# EAGLE design Draft 2 (EAGLE 9.6.2)
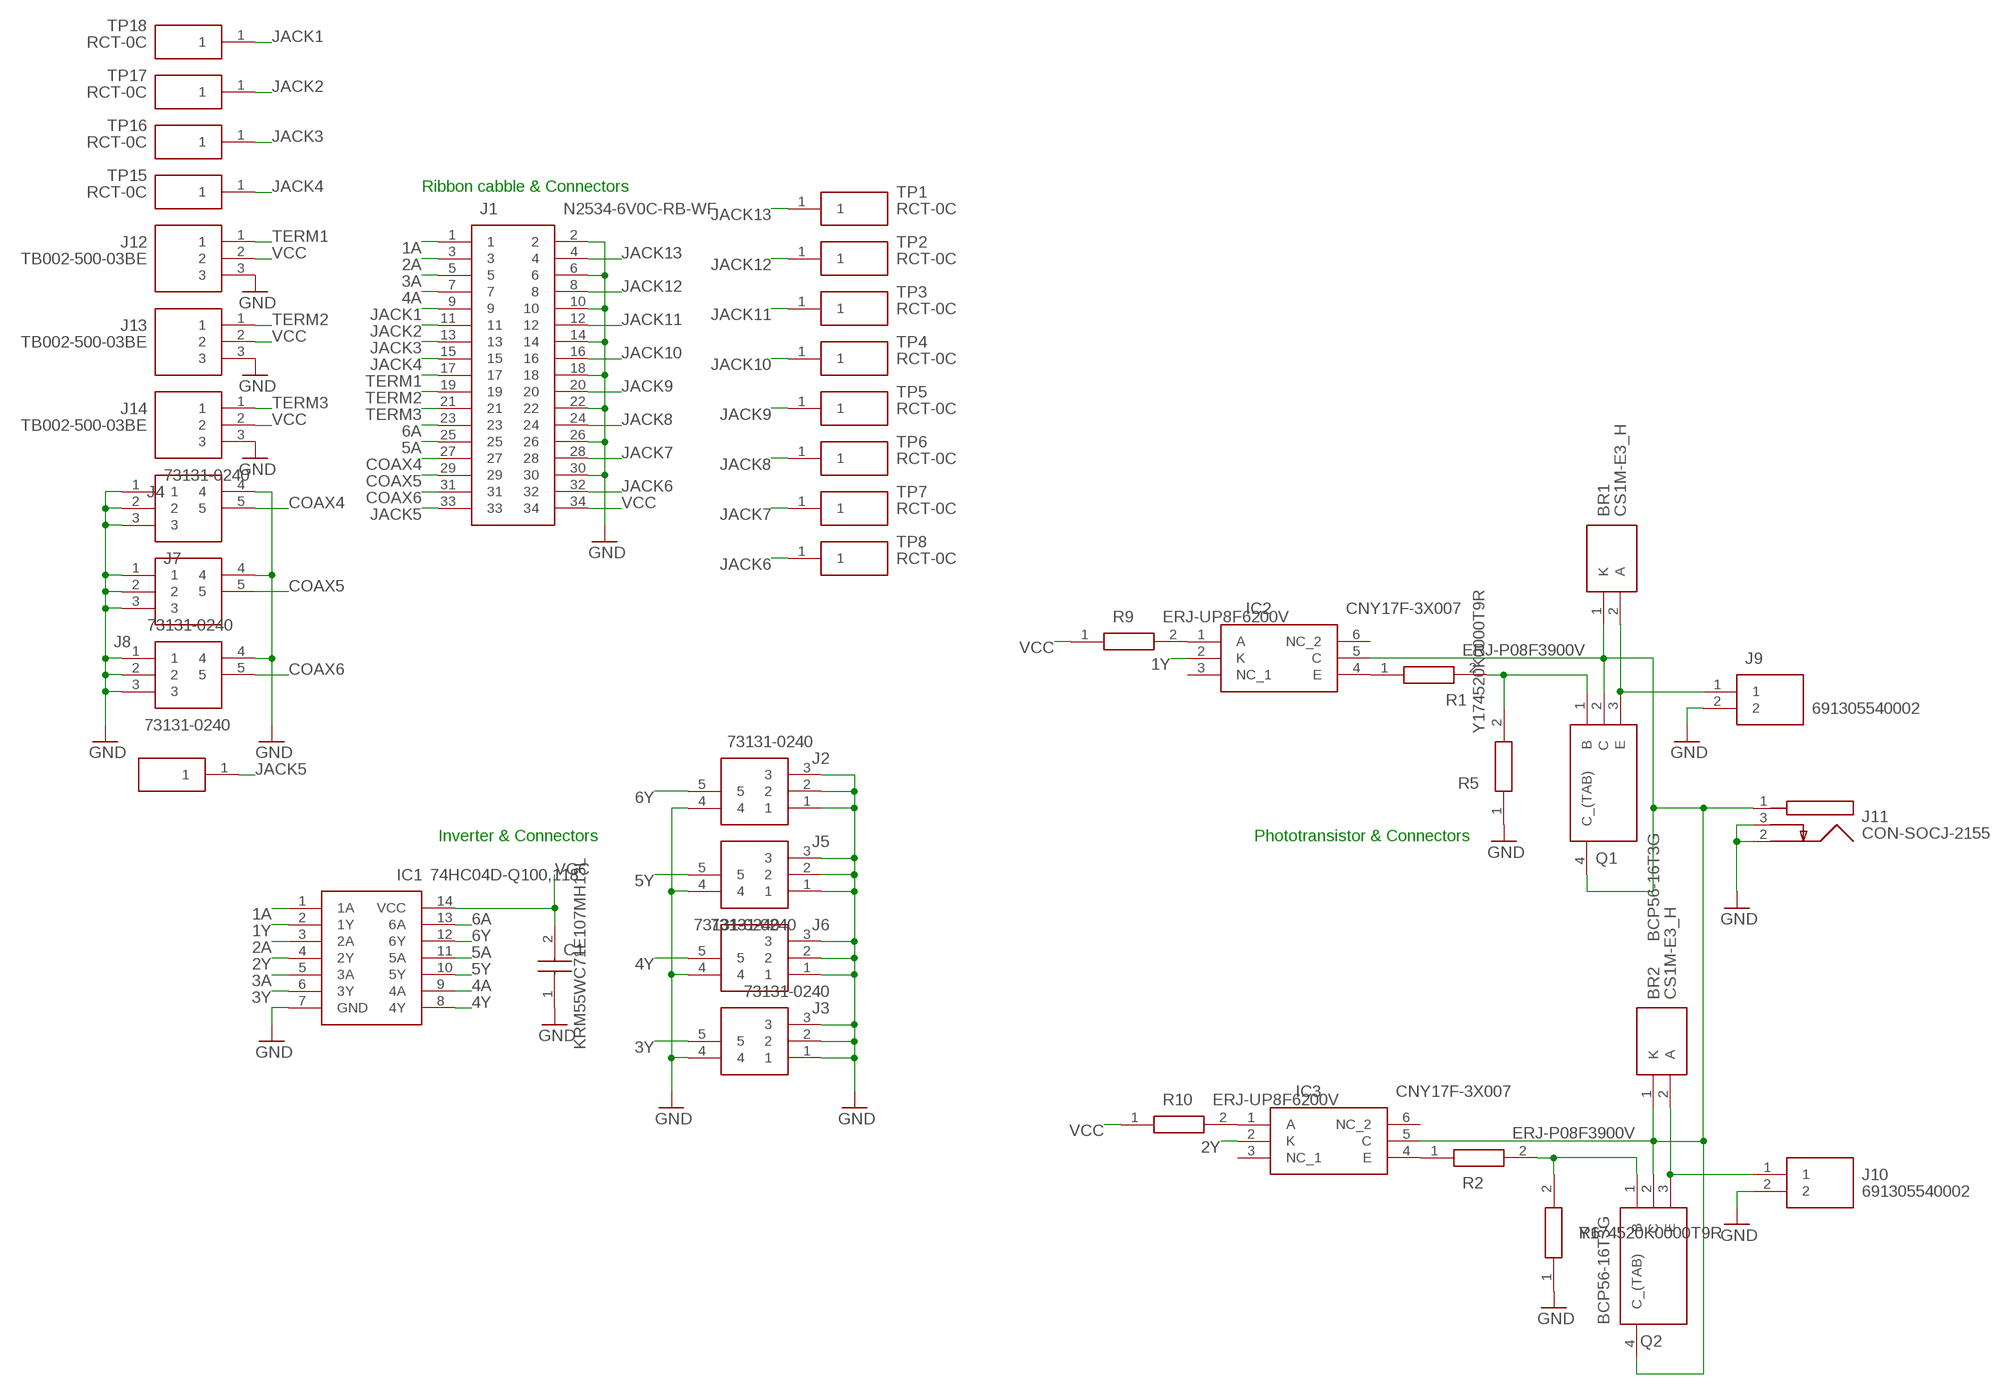
[diagram p0: schematic, sheet 1]

## Parts
BR1  CS1M-E3_H  [DIOM5127X229N]
BR2  CS1M-E3_H  [DIOM5127X229N]
C1  KRM55WC71E107MH13L  [CAPC6153X670N]
IC1  74HC04D-Q100,118  [SOIC127P600X175-14N]
IC2  CNY17F-3X007  [SOP254P1030X440-6N]
IC3  CNY17F-3X007  [SOP254P1030X440-6N]
J1  N2534-6V0C-RB-WF  [3M_N2534-6V0C-RB-WF]
J2  73131-0240  [731310240]
J3  73131-0240  [731310240]
J4  73131-0240  [731310240]
J5  73131-0240  [731310240]
J6  73131-0240  [731310240]
J7  73131-0240  [731310240]
J8  73131-0240  [731310240]
J9  691305540002  [SHDRRA2W100P0X508_1X2_1216X120]
J10  691305540002  [SHDRRA2W100P0X508_1X2_1216X120]
J11  CON-SOCJ-2155  [CONSOCJ2155]
J12  TB002-500-03BE  [SHDR3W100P0X500_1X3_1500X760X1]
J13  TB002-500-03BE  [SHDR3W100P0X500_1X3_1500X760X1]
J14  TB002-500-03BE  [SHDR3W100P0X500_1X3_1500X760X1]
Q1  BCP56-16T3G  [SOT230P700X175-4N]
Q2  BCP56-16T3G  [SOT230P700X175-4N]
R1  ERJ-P08F3900V  [RESC3116X70N]
R2  ERJ-P08F3900V  [RESC3116X70N]
R5  Y174520K0000T9R  [RESM6032X279N]
R6  Y174520K0000T9R  [RESM6032X279N]
R9  ERJ-UP8F6200V  [RESC3116X70N]
R10  ERJ-UP8F6200V  [RESC3116X70N]
TP1  RCT-0C  [RCT-0C]
TP2  RCT-0C  [RCT-0C]
TP3  RCT-0C  [RCT-0C]
TP4  RCT-0C  [RCT-0C]
TP5  RCT-0C  [RCT-0C]
TP6  RCT-0C  [RCT-0C]
TP7  RCT-0C  [RCT-0C]
TP8  RCT-0C  [RCT-0C]
TP9  RCT-0C  [RCT-0C]
TP15  RCT-0C  [RCT-0C]
TP16  RCT-0C  [RCT-0C]
TP17  RCT-0C  [RCT-0C]
TP18  RCT-0C  [RCT-0C]

## Nets
1A: IC1.1(1A) J1.1
1Y: IC1.2(1Y) IC2.2(K)
2A: IC1.3(2A) J1.3
2Y: IC1.4(2Y) IC3.2(K)
3A: IC1.5(3A) J1.5
3Y: IC1.6(3Y) J3.5
4A: IC1.9(4A) J1.7
4Y: IC1.8(4Y) J6.5
5A: IC1.11(5A) J1.25
5Y: IC1.10(5Y) J5.5
6A: IC1.13(6A) J1.23
6Y: IC1.12(6Y) J2.5
COAX4: J1.27 J4.5
COAX5: J1.29 J7.5
COAX6: J1.31 J8.5
GND: C1.1 IC1.7(GND) J1.2 J1.6 J1.10 J1.14 J1.18 J1.22 J1.26 J1.30 J2.1 J2.2 J2.3 J2.4 J3.1 J3.2 J3.3 J3.4 J4.1 J4.2 J4.3 J4.4 J5.1 J5.2 J5.3 J5.4 J6.1 J6.2 J6.3 J6.4 J7.1 J7.2 J7.3 J7.4 J8.1 J8.2 J8.3 J8.4 J9.2 J10.2 J11.2 J11.3 J12.3 J13.3 J14.3 R5.1 R6.1
JACK1: J1.9 TP18.1
JACK2: J1.11 TP17.1
JACK3: J1.13 TP16.1
JACK4: J1.15 TP15.1
JACK5: J1.33 TP9.1
JACK6: J1.32 TP8.1
JACK7: J1.28 TP7.1
JACK8: J1.24 TP6.1
JACK9: J1.20 TP5.1
JACK10: J1.16 TP4.1
JACK11: J1.12 TP3.1
JACK12: J1.8 TP2.1
JACK13: J1.4 TP1.1
N$1: IC2.1(A) R9.2
N$2: BR2.2(A) J10.1 Q2.3(E)
N$3: Q1.1(B) R1.2 R5.2
N$4: IC3.1(A) R10.2
N$5: IC3.4(E) R2.1
N$6: IC2.4(E) R1.1
N$7: BR1.2(A) J9.1 Q1.3(E)
N$8: BR1.1(K) BR2.1(K) IC2.5(C) IC3.5(C) J11.1 Q1.2(C) Q1.4(C_(TAB)) Q2.2(C) Q2.4(C_(TAB))
N$11: Q2.1(B) R2.2 R6.2
TERM1: J1.17 J12.1
TERM2: J1.19 J13.1
TERM3: J1.21 J14.1
VCC: C1.2 IC1.14(VCC) J1.34 J12.2 J13.2 J14.2 R9.1 R10.1
Unconnected: IC2.3(NC_1) IC2.6(NC_2) IC3.3(NC_1) IC3.6(NC_2)

## Notes on the sheet
- Ribbon cabble & Connectors
- Inverter & Connectors | Phototransistor & Connectors

## Library data of the parts
BR1 BR2 = SamacSys_Parts:CS1M-E3_H: 1A, 1000V, SMA, STD GPP SM REC Source: Datasheet <https://www.arrow.com/en/products/cs1m-e3h/vishay>; DESCRIPTION: 1A, 1000V, SMA, STD GPP SM REC; HEIGHT: 2.29mm; MANUFACTURER_NAME: Vishay; MANUFACTURER_PART_NUMBER: CS1M-E3/H; MOUSER_PART_NUMBER: 78-CS1M-E3/H; MOUSER_PRICE-STOCK: https://www.mouser.co.uk/ProductDetail/Vishay-Semiconductors/CS1M-E3-H?qs=rKqJIm0tnYHmxMgyZiw7hg%3D%3D
C1 = SamacSys_Parts:KRM55WC71E107MH13L: Capacitor KRM55 L=6.1mm W=5.3mm T=6.4mm Source: Datasheet <https://psearch.en.murata.com/capacitor/product/KRM55WC71E107MH13#.html>; DESCRIPTION: Capacitor KRM55 L=6.1mm W=5.3mm T=6.4mm; HEIGHT: 6.7mm; MANUFACTURER_NAME: Murata Electronics; MANUFACTURER_PART_NUMBER: KRM55WC71E107MH13L; MOUSER_PART_NUMBER: 81-KRM55WC71E107MH3L; MOUSER_PRICE-STOCK: https://www.mouser.co.uk/ProductDetail/Murata-Electronics/KRM55WC71E107MH13L?qs=rrS6PyfT74e7c6qJ%252BBHpFw%3D%3D
IC1 = SamacSys_Parts:74HC04D-Q100,118: 74HC(T)04-Q100 - Hex inverter@en-us Source: Datasheet <https://assets.nexperia.com/documents/data-sheet/74HC_HCT04_Q100.pdf>; DESCRIPTION: 74HC(T)04-Q100 - Hex inverter@en-us; HEIGHT: 1.75mm; MANUFACTURER_NAME: Nexperia; MANUFACTURER_PART_NUMBER: 74HC04D-Q100,118; MOUSER_PART_NUMBER: 771-74HC04D-Q100; MOUSER_PRICE-STOCK: https://www.mouser.co.uk/ProductDetail/Nexperia/74HC04D-Q100118?qs=1sbE9T7hb3aCZG2r%2FgRdOw%3D%3D
IC2 IC3 = SamacSys_Parts:CNY17F-3X007: Transistor Output Optocouplers Phototransistor Out Single CTR 100-200% Source: Datasheet <http://www.vishay.com/docs/83607/cny17f.pdf>; DESCRIPTION: Transistor Output Optocouplers Phototransistor Out Single CTR 100-200%; HEIGHT: 4.4mm; MANUFACTURER_NAME: Vishay; MANUFACTURER_PART_NUMBER: CNY17F-3X007; MOUSER_PART_NUMBER: 782-CNY17F-3X007; MOUSER_PRICE-STOCK: https://www.mouser.com/Search/Refine.aspx?Keyword=782-CNY17F-3X007
J1 = SamacSys_Parts:N2534-6V0C-RB-WF: Header Source: Datasheet; DESCRIPTION: Header; HEIGHT: mm; MANUFACTURER_NAME: 3M; MANUFACTURER_PART_NUMBER: N2534-6V0C-RB-WF; MOUSER_PART_NUMBER: 517-N2534-6V0C-RB-WF; MOUSER_PRICE-STOCK: https://www.mouser.co.uk/ProductDetail/3M-Electronic-Solutions-Division/N2534-6V0C-RB-WF?qs=Lbk6Md3wKLv0ax0Gs1M41Q%3D%3D; RS_PART_NUMBER: 0212650; RS_PRICE-STOCK: http://uk.rs-online.com/web/p/products/0212650
J2-J8 = SamacSys_Parts:73131-0240: RF Connectors / Coaxial Connectors 50 OHM BNC JACK R/A R/A PCB RECEPTACLE Source: Datasheet <https://www.mouser.com/datasheet/2/276/0731310240_RF_COAX_CONNECTORS-173081.pdf>; ARROW_PART_NUMBER: 73131-0240; DESCRIPTION: RF Connectors / Coaxial Connectors 50 OHM BNC JACK R/A R/A PCB RECEPTACLE; HEIGHT: 18.6mm; MANUFACTURER_NAME: Molex; MANUFACTURER_PART_NUMBER: 73131-0240; MOUSER_PART_NUMBER: 538-73131-0240; MOUSER_PRICE-STOCK: https://www.mouser.co.uk/ProductDetail/Molex/73131-0240?qs=zjYOnnZgb1sGqulDfbggfg%3D%3D
J9 J10 = SamacSys_Parts:691305540002: 5.08 mm Terminal Block PCB Header Horizo Source: Datasheet <https://www.we-online.com/catalog/datasheet/691305540002.pdf>; ARROW_PART_NUMBER: 691305540002; DESCRIPTION: 5.08 mm Terminal Block PCB Header Horizo; HEIGHT: 9.2mm; MANUFACTURER_NAME: Wurth Elektronik; MANUFACTURER_PART_NUMBER: 691305540002; MOUSER_PART_NUMBER: 710-691305540002; MOUSER_PRICE-STOCK: https://www.mouser.co.uk/ProductDetail/Wurth-Elektronik/691305540002?qs=2WXlatMagcE8Kf37bwMEoA%3D%3D
J11 = SamacSys_Parts:CON-SOCJ-2155: DC Power Connectors Power Jack/Connector 2.1mm x 5.5mm Source: Datasheet <http://www.produktinfo.conrad.com/datenblaetter/1500000-1599999/001582350-da-01-en-DC_EINBAUBUCHSE__SCHALTER_GESCHLOSSEN.pdf>; ARROW_PART_NUMBER: CON-SOCJ-2155; DESCRIPTION: DC Power Connectors Power Jack/Connector 2.1mm x 5.5mm; HEIGHT: 11mm; MANUFACTURER_NAME: Gravitech; MANUFACTURER_PART_NUMBER: CON-SOCJ-2155; MOUSER_PART_NUMBER: 992-CON-SOCJ-2155; MOUSER_PRICE-STOCK: https://www.mouser.co.uk/ProductDetail/Gravitech/CON-SOCJ-2155?qs=fkzBJ5HM%252BdCcpvFQyQZHtA%3D%3D
J12-J14 = SamacSys_Parts:TB002-500-03BE: Fixed Terminal Blocks screw type, 5.00 , horizontal, 3 poles, CUI Blue, slotted screw, PCB mount Source: Datasheet <https://www.cuidevices.com/product/resource/tb002-500.pdf>; ARROW_PART_NUMBER: TB002-500-03BE; ARROW_PRICE-STOCK: https://www.arrow.com/en/products/tb002-500-03be/cui-inc; DESCRIPTION: Fixed Terminal Blocks screw type, 5.00 , horizontal, 3 poles, CUI Blue, slotted screw, PCB mount; HEIGHT: 10mm; MANUFACTURER_NAME: CUI Devices; MANUFACTURER_PART_NUMBER: TB002-500-03BE; MOUSER_PART_NUMBER: 490-TB002-500-03BE; MOUSER_PRICE-STOCK: https://www.mouser.co.uk/ProductDetail/CUI-Devices/TB002-500-03BE?qs=vLWxofP3U2xKqUO2wcZ40g%3D%3D
Q1 Q2 = SamacSys_Parts:BCP56-16T3G: Source: Datasheet <http://www.onsemi.com/pub/Collateral/BCP56T1-D.PDF>; ALLIED_NUMBER: 70275391; ALLIED_PRICE-STOCK: http://www.alliedelec.com/on-semiconductor-bcp56-16t3g/70275391/; HEIGHT: 1.75mm; MANUFACTURER_NAME: ON Semiconductor; MANUFACTURER_PART_NUMBER: BCP56-16T3G; MOUSER_PART_NUMBER: 863-BCP56-16T3G; MOUSER_PRICE-STOCK: https://www.mouser.co.uk/ProductDetail/ON-Semiconductor/BCP56-16T3G?qs=vNc2DXHODiKP3hbUlJd5DQ%3D%3D; RS_PART_NUMBER: 7737633P; RS_PRICE-STOCK: http://uk.rs-online.com/web/p/products/7737633P
R1 R2 = SamacSys_Parts:ERJ-P08F3900V: Panasonic ERJP08 Series Thick Film Surface Mount Resistor 1206 Case 390 +/-1% 0.66W +/-100ppm/C Source: Datasheet <http://industrial.panasonic.com/cdbs/www-data/pdf/RDA0000/AOA0000C102.pdf>; DESCRIPTION: Panasonic ERJP08 Series Thick Film Surface Mount Resistor 1206 Case 390 +/-1% 0.66W +/-100ppm/C; HEIGHT: 0.7mm; MANUFACTURER_NAME: Panasonic; MANUFACTURER_PART_NUMBER: ERJ-P08F3900V; MOUSER_PART_NUMBER: 667-ERJ-P08F3900V; MOUSER_PRICE-STOCK: https://www.mouser.co.uk/ProductDetail/Panasonic/ERJ-P08F3900V?qs=iIVTEDlrHA34N3nekEJZFg%3D%3D
R5 R6 = SamacSys_Parts:Y174520K0000T9R: Vishay SMR1DZ Series Metal Foil Fixed Resistor 20k +/-0.01% 0.16W +/-0.2ppm/C Source: Datasheet <http://www.vishaypg.com/docs/63118/smrxdz.pdf>; ALLIED_NUMBER: 70067682; ALLIED_PRICE-STOCK: https://www.alliedelec.com/vishayprecisionfoilinc-y174520k0000t9r/70067682/; DESCRIPTION: Vishay SMR1DZ Series Metal Foil Fixed Resistor 20k +/-0.01% 0.16W +/-0.2ppm/C; HEIGHT: 2.79mm; MANUFACTURER_NAME: Vishay; MANUFACTURER_PART_NUMBER: Y174520K0000T9R; MOUSER_PART_NUMBER: 71-SMR1DZ20K000TST; MOUSER_PRICE-STOCK: https://www.mouser.co.uk/ProductDetail/Vishay-Precision-Group-Foil-Resistors/Y174520K0000T9R?qs=DTo5u7NUXXFYsAqpdaWYtQ%3D%3D; RS_PART_NUMBER: 7637249P; RS_PRICE-STOCK: http://uk.rs-online.com/web/p/products/7637249P
R9 R10 = SamacSys_Parts:ERJ-UP8F6200V: Thick Film Resistors - SMD 1206 0.66W 1% 620ohm Anti-Sulfur AEC-Q200 Source: Datasheet <https://www.mouser.com/datasheet/2/315/AOA0000C337-1276285.pdf>; DESCRIPTION: Thick Film Resistors - SMD 1206 0.66W 1% 620ohm Anti-Sulfur AEC-Q200; HEIGHT: 0.7mm; MANUFACTURER_NAME: Panasonic; MANUFACTURER_PART_NUMBER: ERJ-UP8F6200V; MOUSER_PART_NUMBER: 667-ERJ-UP8F6200V; MOUSER_PRICE-STOCK: https://www.mouser.co.uk/ProductDetail/Panasonic/ERJ-UP8F6200V?qs=gTYE2QTfZfQ%252BTsOVxw%252Bj1A%3D%3D
TP1-TP9 TP15-TP18 = SamacSys_Parts:RCT-0C: TE CONNECTIVITY / CGS - RCT-0C - TEST POINT, 0805 CASE SIZE Source: Datasheet <http://www.farnell.com/datasheets/80691.pdf>; ARROW_PART_NUMBER: RCT-0C; ARROW_PRICE-STOCK: https://www.arrow.com/en/products/rct-0c/te-connectivity; DESCRIPTION: TE CONNECTIVITY / CGS - RCT-0C - TEST POINT, 0805 CASE SIZE; HEIGHT: mm; MANUFACTURER_NAME: TE Connectivity; MANUFACTURER_PART_NUMBER: RCT-0C; MOUSER_PART_NUMBER: 279-RCT-0C; MOUSER_PRICE-STOCK: https://www.mouser.co.uk/ProductDetail/TE-Connectivity-Holsworthy/RCT-0C?qs=ip69W3eHERWzZOsRKmFYAw%3D%3D

## Net classes
0 default: width 0.508 mm

## Board
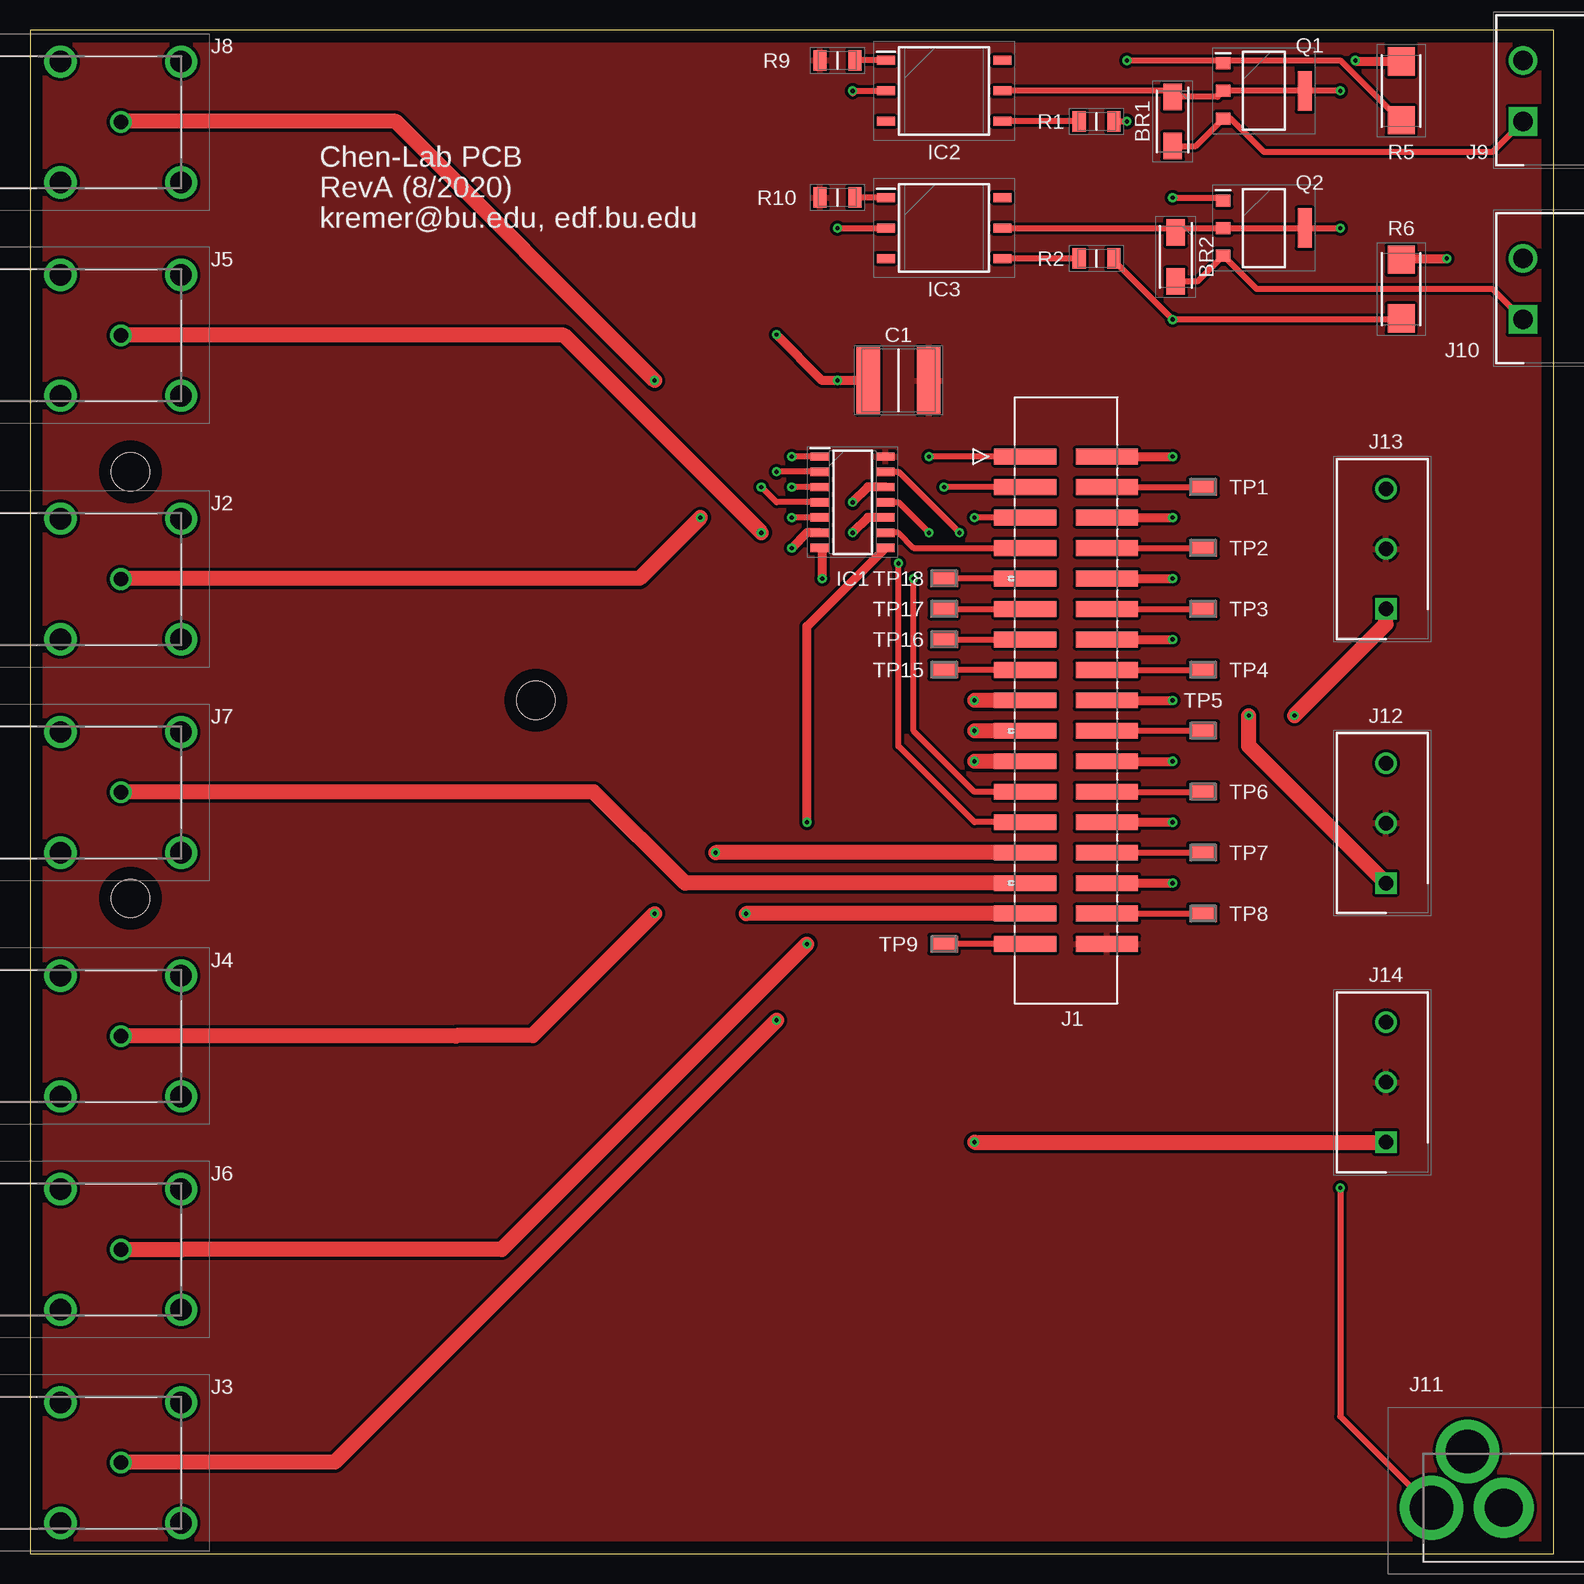
[diagram p1: board, top side]
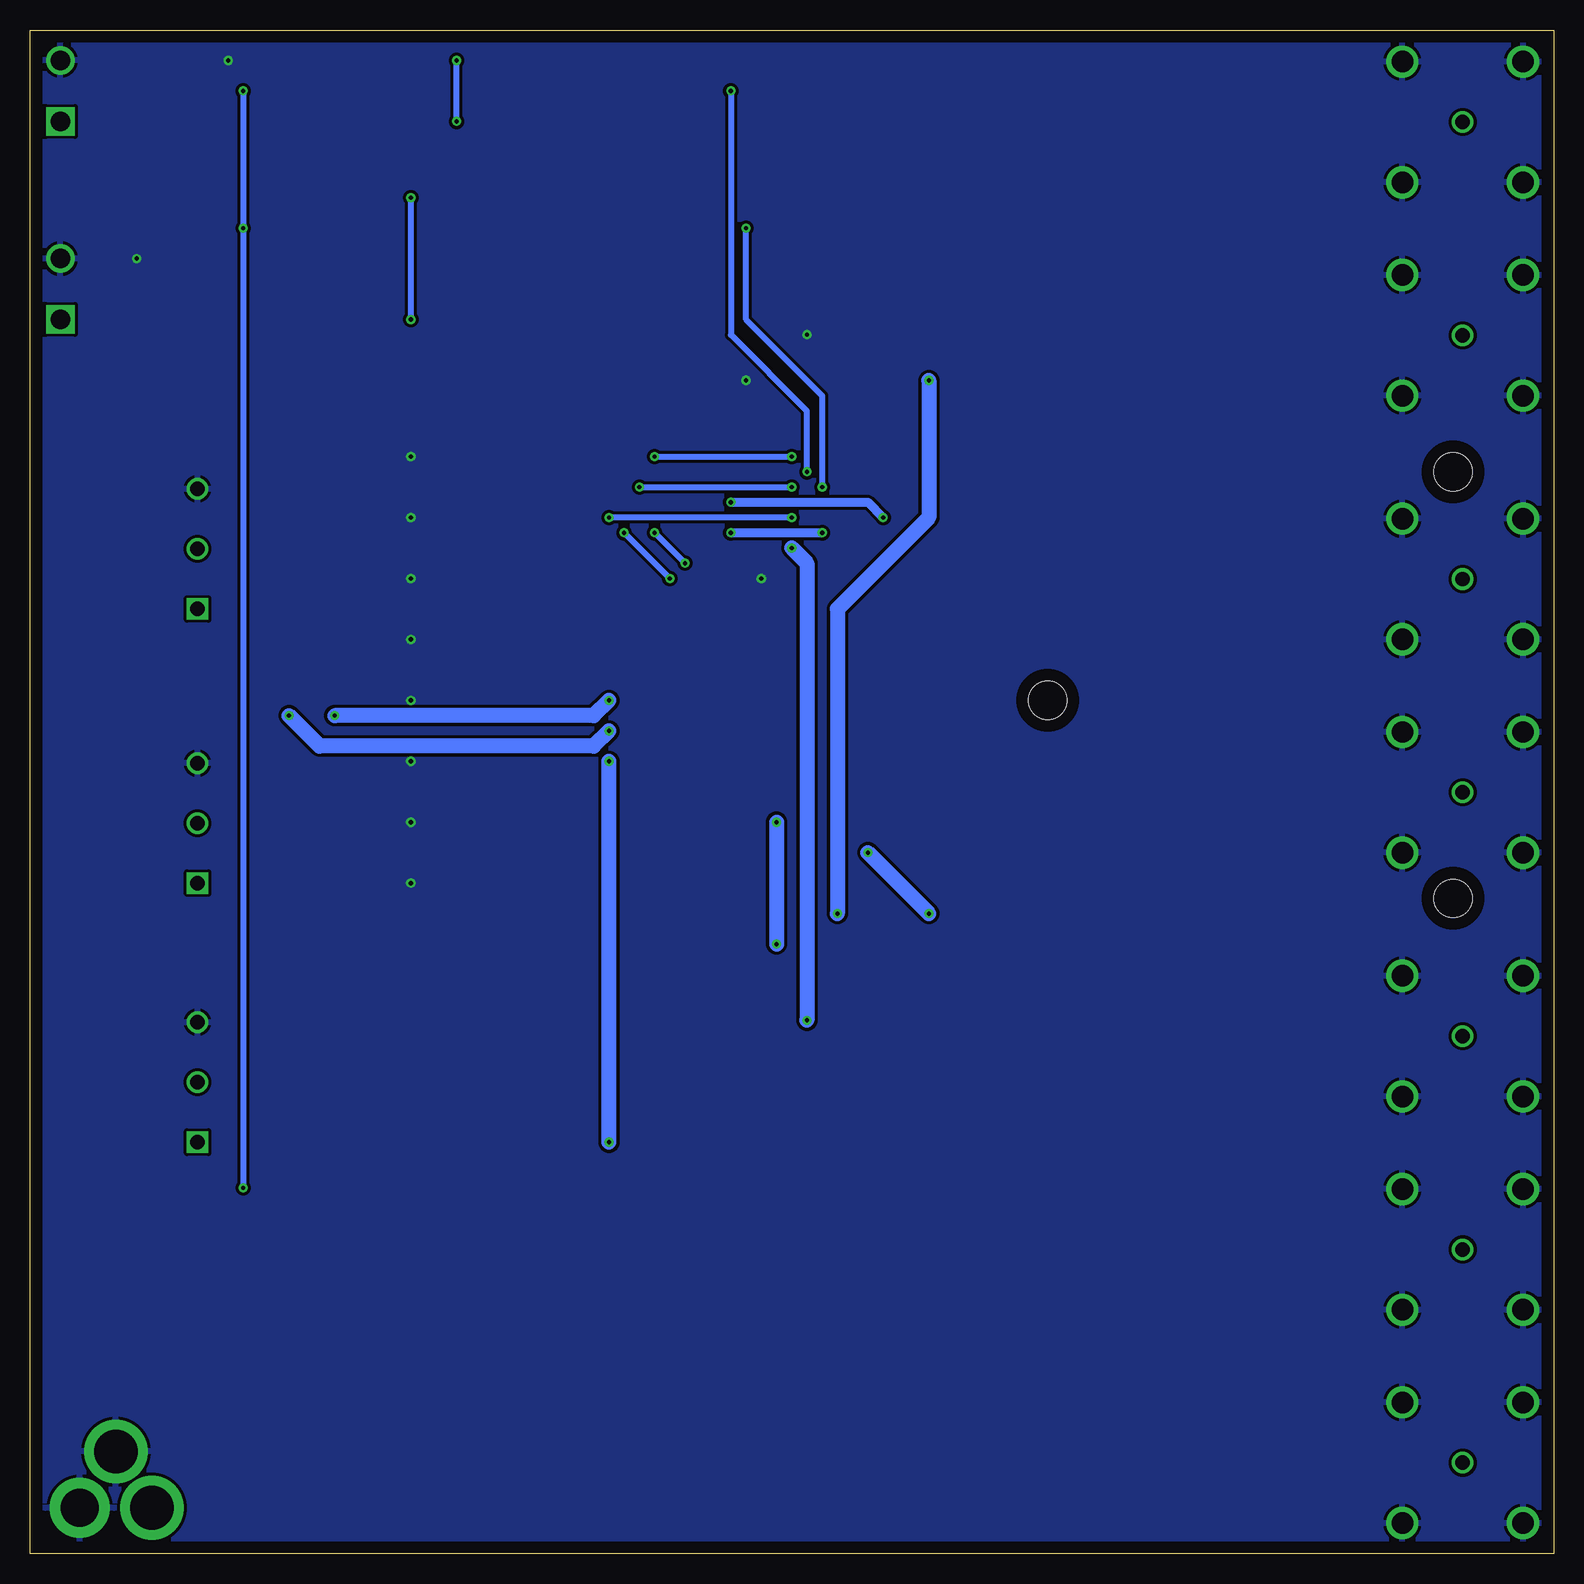
[diagram p2: board, bottom side, seen from below]

Size 127 x 127 mm. Coordinates in mm from the lower left corner, seen from the top.
Outline: 0,0 127,0 127,127 0,127 0,0
Copper layers (1*16): Top 0.035mm / dielectric 1.5mm / Bottom 0.035mm
Design rules "default": minimum track width 6mil, minimum drill 0.35mm, track to track 6mil, track to pad 6mil, pad to pad 6mil, via to via 6mil, smd to smd 6mil, copper to edge 40mil, drill to drill 6mil, minimum pad ring 10mil, minimum via ring 8mil, stop-mask expansion 4mil, vias tented up to drill 0mil, thermal gap 10mil
Holes 3.17 mm at 8.38,54.61 8.38,90.17 42.16,71.12

### Footprints (pad centres in the part's own frame; a part is rotated, then mirrored left to right if it is on the bottom)
DIOM5127X229N = smd 2.2 x 1.55: 1 -2.05,0; 2 2.05,0
CAPC6153X670N = smd 1.95 x 5.52: 1 -2.53,0; 2 2.53,0
SOIC127P600X175-14N = smd 1.55 x 0.7: 1 -2.725,3.81; 2 -2.725,2.54; 3 -2.725,1.27; 4 -2.725,0; 5 -2.725,-1.27; 6 -2.725,-2.54; 7 -2.725,-3.81; 8 2.725,-3.81; 9 2.725,-2.54; 10 2.725,-1.27; 11 2.725,0; 12 2.725,1.27; 13 2.725,2.54; 14 2.725,3.81
SOP254P1030X440-6N = smd 1.5 x 0.75: 1 -4.85,2.54; 2 -4.85,0; 3 -4.85,-2.54; 4 4.85,-2.54; 5 4.85,0; 6 4.85,2.54
3M_N2534-6V0C-RB-WF = smd 1.321 x 5.182: 1 -20.32,-3.404; 2 -20.32,3.404; 3 -17.78,-3.404; 4 -17.78,3.404; 5 -15.24,-3.404; 6 -15.24,3.404; 7 -12.7,-3.404; 8 -12.7,3.404; 9 -10.16,-3.404; 10 -10.16,3.404; 11 -7.62,-3.404; 12 -7.62,3.404; 13 -5.08,-3.404; 14 -5.08,3.404; 15 -2.54,-3.404; 16 -2.54,3.404; 17 0,-3.404; 18 0,3.404; 19 2.54,-3.404; 20 2.54,3.404; 21 5.08,-3.404; 22 5.08,3.404; 23 7.62,-3.404; 24 7.62,3.404; 25 10.16,-3.404; 26 10.16,3.404; 27 12.7,-3.404; 28 12.7,3.404; 29 15.24,-3.404; 30 15.24,3.404; 31 17.78,-3.404; 32 17.78,3.404; 33 20.32,-3.404; 34 20.32,3.404
731310240 = drill 1.79 pad 2.685: 1 0,0; 2 0,10.06; 3 10.06,0; 4 10.06,10.06 | drill 1.2 pad 1.8: 5 5.03,5.03
SHDRRA2W100P0X508_1X2_1216X120 = drill 1.6 pad 2.4 square: 1 0,0 | drill 1.6 pad 2.4: 2 5.08,0
CONSOCJ2155 = drill 3.64 pad 5.3: 1 0,0; 3 -3,-4.7 | drill 3.162 pad 5: 2 -6,0
SHDR3W100P0X500_1X3_1500X760X1 = drill 1.2 pad 1.8 square: 1 0,0 | drill 1.2 pad 1.8: 2 5,0; 3 10,0
SOT230P700X175-4N = smd 1.2 x 1: 1 -3.4,2.3; 2 -3.4,0; 3 -3.4,-2.3 | smd 1.2 x 3.3: 4 3.4,0
RESC3116X70N = smd 1.1 x 1.7: 1 -1.45,0; 2 1.45,0
RESM6032X279N = smd 2.35 x 2.25: 1 -2.45,0; 2 2.45,0
RCT-0C = smd 2.3 x 1.4: 1 0,0

### Placement (x,y rotation side)
BR1  95.25,119.38 270 top
BR2  95.5,108.08 270 top
C1  72.39,97.79 0 top
IC1  68.58,87.63 0 top
IC2  76.2,121.92 0 top
IC3  76.2,110.49 0 top
J1  86.36,71.12 270 top
J2  2.54,76.2 0 top
J3  2.54,2.54 0 top
J4  2.54,38.1 0 top
J5  2.54,96.52 0 top
J6  2.54,20.32 0 top
J7  2.54,58.42 0 top
J8  2.54,114.3 0 top
J9  124.46,119.38 90 top
J10  124.46,102.87 90 top
J11  116.84,3.81 180 top
J12  113.03,55.88 90 top
J13  113.03,78.74 90 top
J14  113.03,34.29 90 top
Q1  102.87,121.92 0 top
Q2  102.87,110.49 0 top
R1  88.9,119.38 0 top
R2  88.9,107.95 0 top
R5  114.3,121.92 270 top
R6  114.3,105.41 270 top
R9  67.31,124.46 0 top
R10  67.31,113.03 0 top
TP1  97.79,88.9 0 top
TP2  97.79,83.82 0 top
TP3  97.79,78.74 0 top
TP4  97.79,73.66 0 top
TP5  97.79,68.58 0 top
TP6  97.79,63.5 0 top
TP7  97.79,58.42 0 top
TP8  97.79,53.34 0 top
TP9  76.2,50.8 0 top
TP15  76.2,73.66 0 top
TP16  76.2,76.2 0 top
TP17  76.2,78.74 0 top
TP18  76.2,81.28 0 top

### Tracks (layer width: path | path; a pad name or v marks a point on that pad's centre or on a via)
1A  (via drill 0.35)
  Top 0.508: IC1.1 v63.5,91.44 | J1.1 v74.93,91.44
  Bottom 0.508: v74.93,91.44 v63.5,91.44
1Y  (via drill 0.35)
  Top 0.508: IC1.2 v62.23,90.17 | v68.58,121.92 68.58,121.69 68.81,121.92 IC2.2
  Bottom 0.508: v62.23,90.17 62.23,95.25 68.58,101.6 v68.58,121.92
2A  (via drill 0.35)
  Top 0.508: IC1.3 v63.5,88.9 | J1.3 v76.2,88.9
  Bottom 0.508: v76.2,88.9 v63.5,88.9
2Y  (via drill 0.35)
  Top 0.508: IC1.4 62.23,87.63 v60.96,88.9 | v67.31,110.49 IC3.2
  Bottom 0.508: v60.96,88.9 60.96,96.52 67.31,102.87 v67.31,110.49
3A  (via drill 0.35)
  Top 0.508: J1.5 v78.74,86.36 | IC1.5 v63.5,86.36
  Bottom 0.508: v63.5,86.36 v78.74,86.36
3Y  (via drill 0.35)
  Top 0.508: 7.62,7.62 J3.5
  Top 0.762: IC1.6 64.77,85.09 v63.5,83.82
  Top 1.27: v62.23,44.45 25.4,7.62 7.62,7.62
  Bottom 1.27: v63.5,83.82 62.23,82.55 v62.23,44.45
4A
  Top 0.508: IC1.9 72.39,85.09 73.66,83.82 J1.7
4Y  (via drill 0.35)
  Top 0.762: v64.77,60.96 64.77,77.28 IC1.8
  Top 1.27: v64.77,50.8 39.32,25.35 12.7,25.35 J6.5
  Bottom 1.27: v64.77,60.96 v64.77,50.8
5A  (via drill 0.35)
  Top 0.508: IC1.11 72.39,87.63 v74.93,85.09 | v72.39,82.55 72.39,67.31 78.74,60.96 J1.25
  Bottom 0.508: v74.93,85.09 v72.39,82.55
5Y  (via drill 0.35)
  Top 0.762: IC1.10 69.85,86.36 v68.58,85.09
  Top 1.27: J5.5 44.5,101.55 v60.96,85.09
  Bottom 0.762: v68.58,85.09 v60.96,85.09
6A  (via drill 0.35)
  Top 0.508: IC1.13 72.39,90.17 v77.47,85.09 | J1.23 78.74,63.5 73.66,68.58 v73.66,81.28
  Bottom 0.508: v73.66,81.28 v77.47,85.09
6Y  (via drill 0.35)
  Top 0.508: 7.62,81.28 J2.5
  Top 0.762: IC1.12 69.85,88.9 v68.58,87.63
  Top 1.27: v55.88,86.36 50.8,81.28 7.62,81.28
  Bottom 0.762: v68.58,87.63 57.15,87.63 v55.88,86.36
COAX4  (via drill 0.35)
  Top 1.27: J1.27 v57.15,58.42 | v52.07,53.34 41.91,43.18 35.56,43.18 35.51,43.13 J4.5
  Bottom 1.27: v57.15,58.42 v52.07,53.34
COAX5
  Top 0.508: 7.62,63.5 J7.5
  Top 1.27: J1.29 54.61,55.88 46.99,63.5 7.62,63.5
COAX6  (via drill 0.35)
  Top 0.508: 7.62,119.38 J8.5
  Top 1.27: J1.31 v59.69,53.34 | v52.07,97.79 30.48,119.38 7.62,119.38
  Bottom 1.27: v59.69,53.34 59.69,78.74 52.07,86.36 v52.07,97.79
GND  (via drill 0.35)
  Top 0.508: 110.58,124.37 v110.49,124.46 | R6.1 114.39,107.95 | IC1.7 66.04,83.64
  Top 0.762: J1.6 v95.25,86.36 | J1.2 v95.25,91.44 | J1.10 v95.25,81.28 | J1.14 v95.25,76.2 | J1.18 v95.25,71.12 | J1.22 v95.25,66.04 | J1.26 v95.25,60.96 | J1.30 v95.25,55.88 | C1.1 v67.31,97.79 66.04,97.79 v62.23,101.6 | R5.1 110.58,124.37 | 114.39,107.95 v118.11,107.95 | 66.04,83.64 v66.04,81.28
  pour Bottom (isolate 0.254): 0,127 127,127 127,0 0,0
JACK1
  Top 0.508: J1.9 TP18.1
JACK2
  Top 0.508: TP17.1 J1.11
JACK3
  Top 0.508: TP16.1 J1.13
JACK4
  Top 0.508: J1.15 TP15.1
JACK5
  Top 0.508: J1.33 TP9.1
JACK6
  Top 0.508: J1.32 TP8.1
JACK7
  Top 0.508: J1.28 TP7.1
JACK8
  Top 0.508: J1.24 TP6.1
JACK9
  Top 0.508: TP5.1 90.17,68.58 J1.20
JACK10
  Top 0.508: J1.16 TP4.1
JACK11
  Top 0.508: J1.12 TP3.1
JACK12
  Top 0.508: J1.8 TP2.1
JACK13
  Top 0.508: J1.4 TP1.1
N$1
  Top 0.508: IC2.1 R9.2
N$2
  Top 0.508: BR2.2 97.31,106.03 Q2.3 102.25,105.41 121.92,105.41 J10.1
N$3  (via drill 0.35)
  Top 0.508: R5.2 114.21,119.47 109.22,124.46 99.71,124.46 Q1.1 99.23,124.46 v91.44,124.46 | R1.2 v91.44,119.38
  Bottom 0.508: v91.44,119.38 v91.44,124.46
N$4
  Top 0.508: IC3.1 R10.2
N$5
  Top 0.508: R2.1 IC3.4
N$6
  Top 0.508: R1.1 IC2.4
N$7
  Top 0.508: BR1.2 97.18,117.33 Q1.3 100.09,119.62 102.87,116.84 121.92,116.84 J9.1
N$8  (via drill 0.35)
  Top 0.508: IC2.5 94.76,121.92 BR1.1 98.98,121.43 Q1.2 Q1.4 v109.22,121.92 | IC3.5 95.14,110.49 BR2.1 95.87,110.49 Q2.2 Q2.4 v109.22,110.49 | J11.1 109.22,11.43 v109.22,30.48
  Bottom 0.508: v109.22,121.92 v109.22,110.49 v109.22,30.48
N$11  (via drill 0.35)
  Top 0.508: R6.2 114.21,102.87 v95.25,102.87 90.35,107.77 R2.2 | v95.25,113.03 99.23,113.03 Q2.1
  Bottom 0.508: v95.25,102.87 v95.25,113.03
TERM1  (via drill 0.35)
  Top 0.508: J1.17 82.55,71.12
  Top 1.27: J12.1 101.6,67.31 v101.6,69.85 | 82.55,71.12 v78.74,71.12
  Bottom 1.27: v78.74,71.12 80.01,69.85 v101.6,69.85
TERM2  (via drill 0.35)
  Top 1.27: J1.19 v78.74,68.58 | v105.41,69.85 113.03,77.47 J13.1
  Bottom 1.27: v78.74,68.58 80.01,67.31 102.87,67.31 v105.41,69.85
TERM3  (via drill 0.35)
  Top 1.27: J1.21 v78.74,66.04 | v78.74,34.29 J14.1
  Bottom 1.27: v78.74,34.29 v78.74,66.04
VCC
  Bottom 0.508: J13.2 113.11,83.74
  pour Top (isolate 0.254): 0,127 127,127 127,0 0,0

### Text on the board
tPlace: Chen-Lab PCB | RevA (8/2020) | kremer@bu.edu, edf.bu.edu